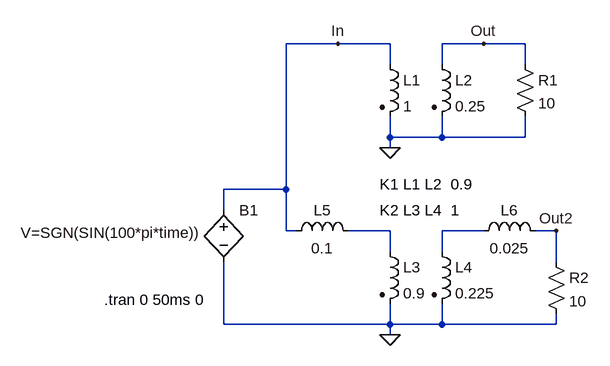
[diagram p0: schematic KTrafo.asc]
KTrafo.asc, the LTspice schematic file:
Version 4
SHEET 1 880 680
WIRE -208 400 -208 368
WIRE -208 576 -208 480
WIRE -112 368 -208 368
WIRE -112 368 -112 144
WIRE -112 432 -112 368
WIRE -96 432 -112 432
WIRE -32 144 -112 144
WIRE 48 144 -32 144
WIRE 48 176 48 144
WIRE 48 288 48 256
WIRE 48 304 48 288
WIRE 48 432 -16 432
WIRE 48 464 48 432
WIRE 48 576 -208 576
WIRE 48 576 48 544
WIRE 48 592 48 576
WIRE 128 176 128 144
WIRE 128 288 48 288
WIRE 128 288 128 256
WIRE 128 464 128 432
WIRE 128 576 48 576
WIRE 128 576 128 544
WIRE 192 144 128 144
WIRE 192 432 128 432
WIRE 256 144 192 144
WIRE 256 176 256 144
WIRE 256 288 128 288
WIRE 256 288 256 256
WIRE 304 432 272 432
WIRE 304 480 304 432
WIRE 304 576 128 576
WIRE 304 576 304 560
FLAG -32 144 In
FLAG 192 144 Out
FLAG 48 304 0
FLAG 304 432 Out2
FLAG 48 592 0
SYMBOL ind2 32 160 R0
SYMATTR InstName L1
SYMATTR Value 1
SYMATTR Type ind
SYMATTR SpiceLine Rser=0.001
SYMBOL ind2 112 160 R0
SYMATTR InstName L2
SYMATTR Value 0.25
SYMATTR Type ind
SYMBOL res 240 160 R0
SYMATTR InstName R1
SYMATTR Value 10
SYMBOL bv -208 384 R0
WINDOW 3 -312 51 Left 0
SYMATTR InstName B1
SYMATTR Value V=SGN(SIN(100*pi*time))
SYMBOL ind2 32 448 R0
SYMATTR InstName L3
SYMATTR Value 0.9
SYMATTR Type ind
SYMATTR SpiceLine Rser=0.001
SYMBOL ind2 112 448 R0
SYMATTR InstName L4
SYMATTR Value 0.225
SYMATTR Type ind
SYMBOL ind -112 448 R270
WINDOW 0 32 56 VTop 0
WINDOW 3 5 56 VBottom 0
SYMATTR InstName L5
SYMATTR Value 0.1
SYMBOL ind 176 448 R270
WINDOW 0 32 56 VTop 0
WINDOW 3 5 56 VBottom 0
SYMATTR InstName L6
SYMATTR Value 0.025
SYMBOL res 288 464 R0
SYMATTR InstName R2
SYMATTR Value 10
TEXT 32 360 Left 0 !K1 L1 L2  0.9
TEXT -392 538 Left 0 !.tran 0 50ms 0
TEXT 32 400 Left 0 !K2 L3 L4  1

The netlist it stands for:
* KTrafo.asc
L1 In 0 1 Rser=0.001
L2 Out 0 0.25
R1 Out 0 10
B1 In 0 V=SGN(SIN(100*pi*time))
L3 N001 0 0.9 Rser=0.001
L4 N002 0 0.225
L5 In N001 0.1
L6 N002 Out2 0.025
R2 Out2 0 10
K1 L1 L2  0.9
.tran 0 50ms 0
K2 L3 L4  1
.backanno
.end